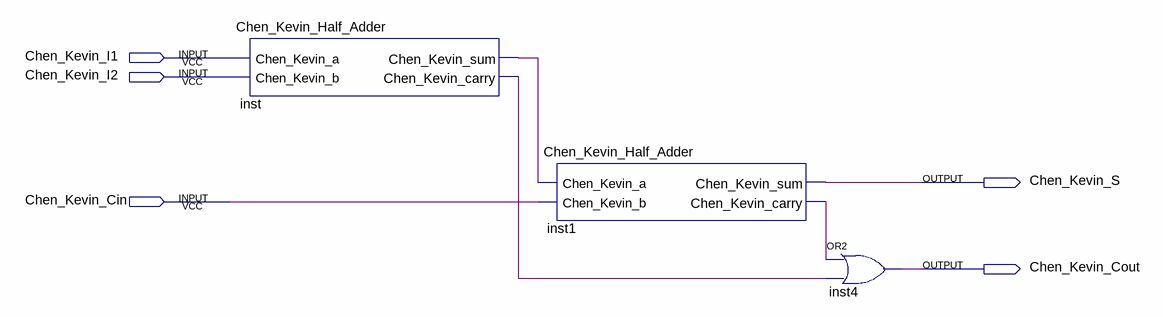
[diagram p0: schematic sheet]
// Quartus schematic Chen_Kevin_1BitFullAdderUsing1BitHalfAdderAsAComponent.bdf as structural Verilog: 3 symbols, 5 pins
module Chen_Kevin_1BitFullAdderUsing1BitHalfAdderAsAComponent (
  input  Chen_Kevin_I1,
  input  Chen_Kevin_I2,
  input  Chen_Kevin_Cin,
  output Chen_Kevin_S,
  output Chen_Kevin_Cout
);

  wire inst1_chen_kevin_carry, inst_chen_kevin_carry, inst_chen_kevin_sum;

  Chen_Kevin_Half_Adder inst (
    .Chen_Kevin_a(Chen_Kevin_I1), .Chen_Kevin_b(Chen_Kevin_I2), .Chen_Kevin_sum(inst_chen_kevin_sum),
    .Chen_Kevin_carry(inst_chen_kevin_carry));
  Chen_Kevin_Half_Adder inst1 (
    .Chen_Kevin_a(inst_chen_kevin_sum), .Chen_Kevin_b(Chen_Kevin_Cin), .Chen_Kevin_sum(Chen_Kevin_S),
    .Chen_Kevin_carry(inst1_chen_kevin_carry));
  or inst4 (Chen_Kevin_Cout, inst1_chen_kevin_carry, inst_chen_kevin_carry);
endmodule
